# Altium project CT8042.PrjPcb
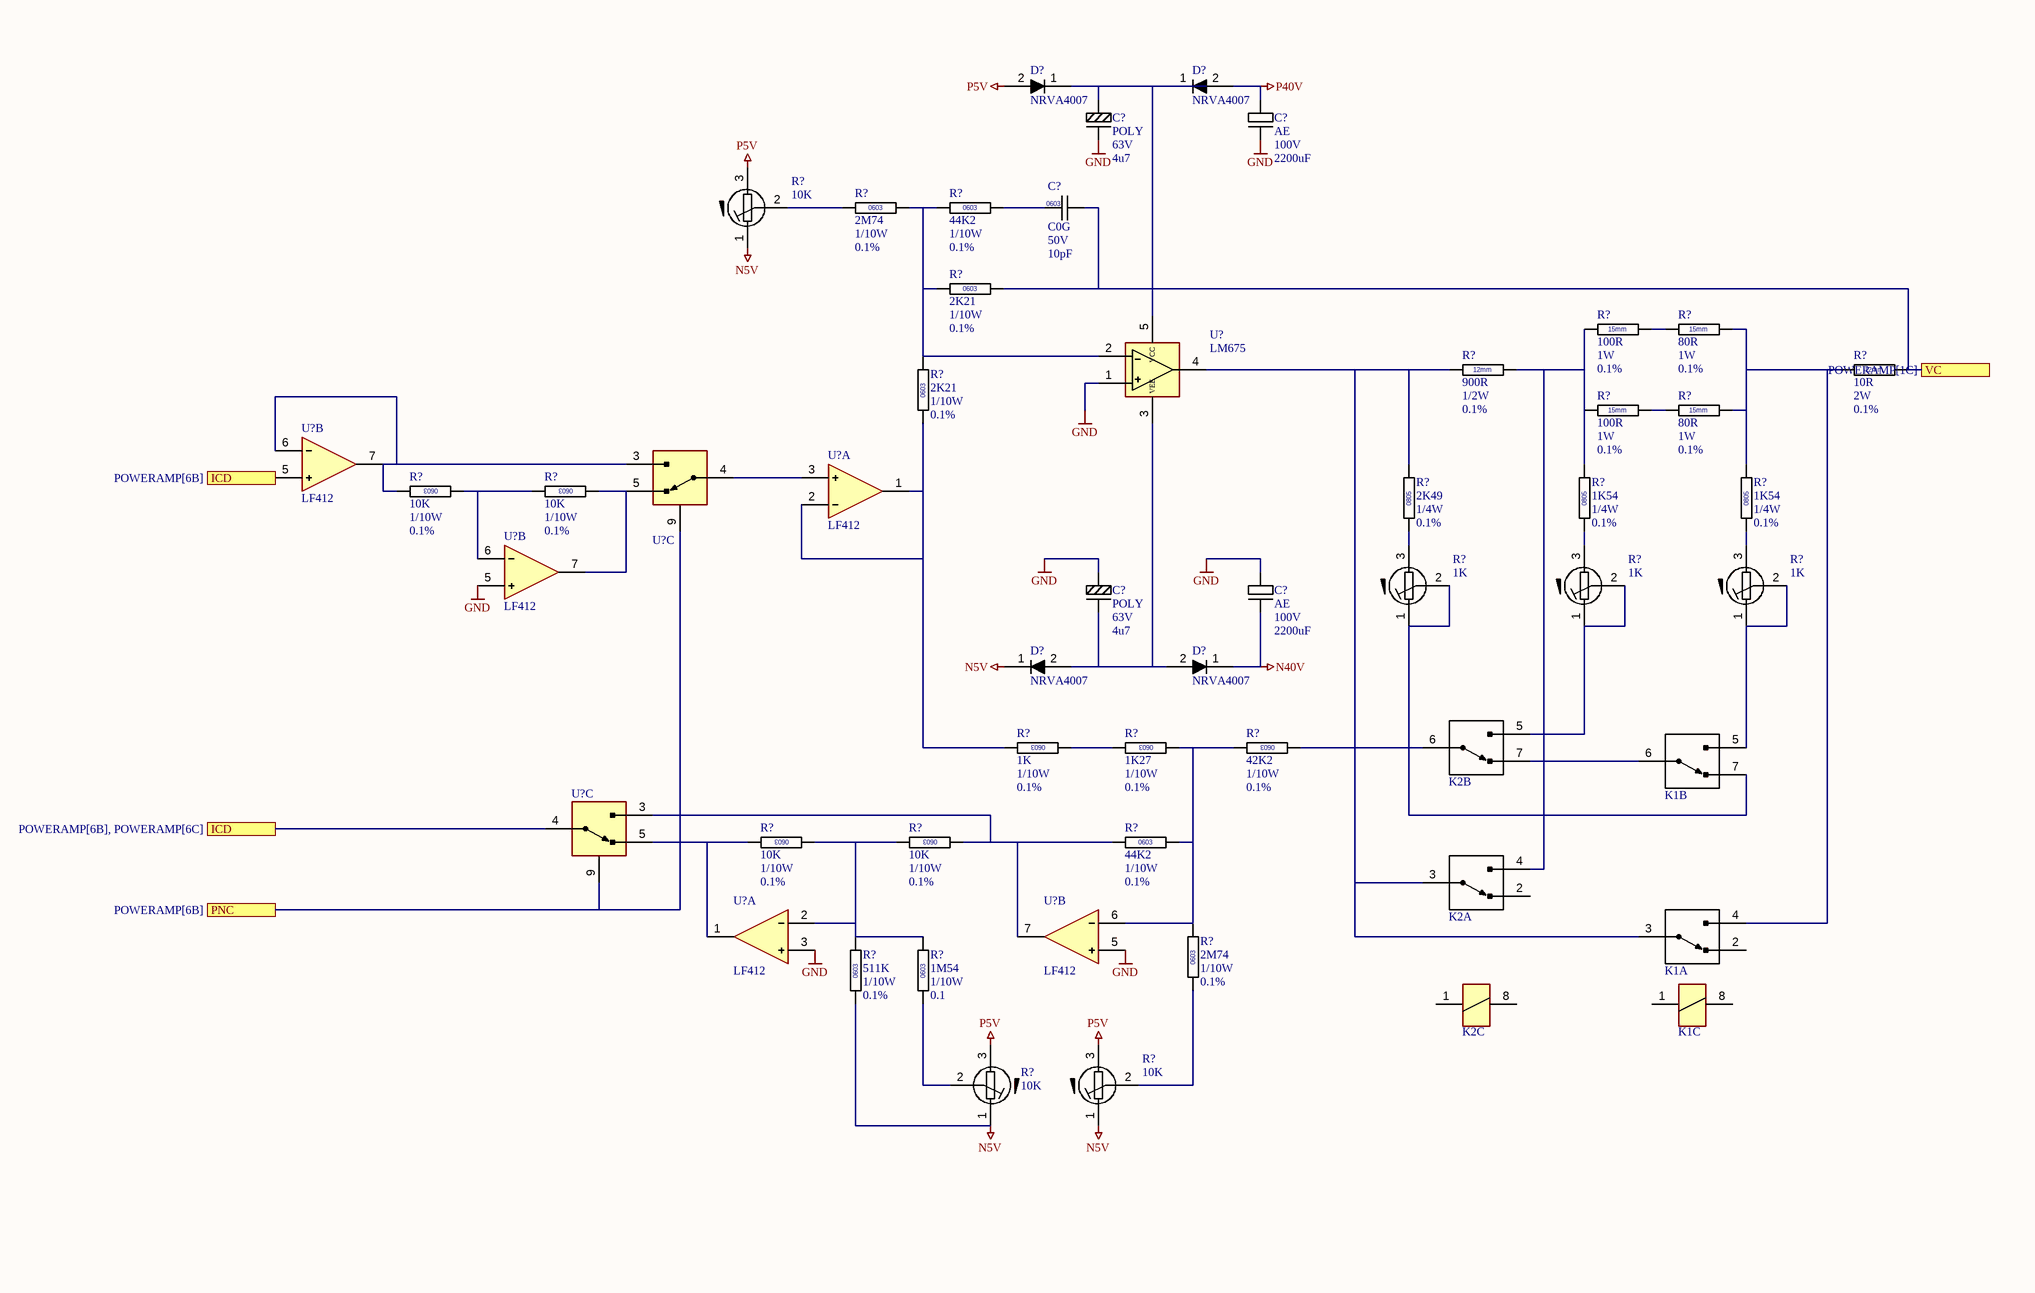
[diagram p0: POWERAMP.SchDoc]
1 sheet, 49 parts. Net scope: flat (ports and power ports of the same name join across sheets).

## Sheet POWERAMP.SchDoc
size B

### Parts
(Parts that share a designator on the sheet are numbered #1, #2 ... from top to bottom, then left to right.)
C?#1  Dielectric: POLY  Voltage: 63V  Capacitance: 4u7  [CAPC0603]  (hidden comment: CAPP)
C?#2  Dielectric: AE  Voltage: 100V  Capacitance: 2200uF  [CAPC0603]  (hidden comment: CAP0603)
C?#3  Dielectric: C0G  Voltage: 50V  Capacitance: 10pF  [CAPC0603]  (hidden comment: CAP0603)
C?#4  Dielectric: POLY  Voltage: 63V  Capacitance: 4u7  [CAPC0603]  (hidden comment: CAPP)
C?#5  Dielectric: AE  Voltage: 100V  Capacitance: 2200uF  [CAPC0603]  (hidden comment: CAP0603)
D?#1  NRVA4007
D?#2  NRVA4007
D?#3  NRVA4007
D?#4  NRVA4007
K1  RELA-OMRON-OMRON G6K-2F-Y-TR DC5  (value not drawn)  (parts A,B,C of 3)
K2  RELA-OMRON-OMRON G6K-2F-Y-TR DC5  (value not drawn)  (parts A,B,C of 3)
R?#1  value 2M74  Power: 1/10W  Tolerance: 0.1%  [RESC0603]  (hidden comment: RESC0603)
R?#2  value 44K2  Power: 1/10W  Tolerance: 0.1%  [RESC0603]  (hidden comment: RESC0603)
R?#3  value 10K  (hidden comment: TRIMMER-BOURNS-3214X-1-103E)
R?#4  value 2K21  Power: 1/10W  Tolerance: 0.1%  [RESC0603]  (hidden comment: RESC0603)
R?#5  value 100R  Power: 1W  Tolerance: 0.1%  [RESC1206]  (hidden comment: RESC1206)
R?#6  value 80R  Power: 1W  Tolerance: 0.1%  [RESC1206]  (hidden comment: RESC1206)
R?#7  value 900R  Power: 1/2W  Tolerance: 0.1%  [RESC1206]  (hidden comment: RESC1206)
R?#8  value 10R  Power: 2W  Tolerance: 0.1%  [RESC1206]  (hidden comment: RESC1206)
R?#9  value 100R  Power: 1W  Tolerance: 0.1%  [RESC1206]  (hidden comment: RESC1206)
R?#10  value 80R  Power: 1W  Tolerance: 0.1%  [RESC1206]  (hidden comment: RESC1206)
R?#11  value 2K21  Power: 1/10W  Tolerance: 0.1%  [RESC0603]  (hidden comment: RESC0603)
R?#12  value 2K49  Power: 1/4W  Tolerance: 0.1%  [RESC0805]  (hidden comment: RESC0805)
R?#13  value 10K  Power: 1/10W  Tolerance: 0.1%  [RESC0603]  (hidden comment: RESC0603)
R?#14  value 10K  Power: 1/10W  Tolerance: 0.1%  [RESC0603]  (hidden comment: RESC0603)
R?#15  value 1K54  Power: 1/4W  Tolerance: 0.1%  [RESC0805]  (hidden comment: RESC0805)
R?#16  value 1K54  Power: 1/4W  Tolerance: 0.1%  [RESC0805]  (hidden comment: RESC0805)
R?#17  value 1K  (hidden comment: TRIMMER-BOURNS-3214X-1-102E)
R?#18  value 1K  (hidden comment: TRIMMER-BOURNS-3214X-1-102E)
R?#19  value 1K  (hidden comment: TRIMMER-BOURNS-3214X-1-102E)
R?#20  value 1K  Power: 1/10W  Tolerance: 0.1%  [RESC0603]  (hidden comment: RESC0603)
R?#21  value 1K27  Power: 1/10W  Tolerance: 0.1%  [RESC0603]  (hidden comment: RESC0603)
R?#22  value 42K2  Power: 1/10W  Tolerance: 0.1%  [RESC0603]  (hidden comment: RESC0603)
R?#23  value 10K  Power: 1/10W  Tolerance: 0.1%  [RESC0603]  (hidden comment: RESC0603)
R?#24  value 10K  Power: 1/10W  Tolerance: 0.1%  [RESC0603]  (hidden comment: RESC0603)
R?#25  value 44K2  Power: 1/10W  Tolerance: 0.1%  [RESC0603]  (hidden comment: RESC0603)
R?#26  value 511K  Power: 1/10W  Tolerance: 0.1%  [RESC0603]  (hidden comment: RESC0603)
R?#27  value 1M54  Power: 1/10W  Tolerance: 0.1  [RESC0603]  (hidden comment: RESC0603)
R?#28  value 2M74  Power: 1/10W  Tolerance: 0.1%  [RESC0603]  (hidden comment: RESC0603)
R?#29  value 10K  (hidden comment: TRIMMER-BOURNS-3214X-1-103E)
R?#30  value 10K  (hidden comment: TRIMMER-BOURNS-3214X-1-103E)
U?#1  LM675
U?#2  LF412  (part B of 3)
U?#3  IC-TI-CD4053-SPLIT  (value not drawn)  (part C of 4)
U?#4  LF412  (part A of 3)
U?#5  LF412  (part B of 3)
U?#6  IC-TI-CD4053-SPLIT  (value not drawn)  (part C of 4)
U?#7  LF412  (part A of 3)
U?#8  LF412  (part B of 3)

### Ports
ICD (see POWERAMP[6B]), ICD (see POWERAMP[6B], POWERAMP[6C]), PNC (see POWERAMP[6B]), VC (see POWERAMP[1C])

### Nets
GND: C?#1.2 C?#2.2 C?#4.1 C?#5.1 U?#1.1(+) U?#5.5(+) U?#7.3(+) U?#8.5(+)
N5V: D?#3.1(K) R?#3.1 R?#26.2 R?#29.1 R?#30.1
N40V: C?#5.2 D?#4.1(K)
P5V: D?#1.2(A) R?#3.3 R?#29.3 R?#30.3
P40V: C?#2.1 D?#2.2(A)
NetC?#1_1: C?#1.1 D?#1.1(K) D?#2.1(K) U?#1.5(VCC)
NetC?#3_1: C?#3.1 R?#2.2
NetC?#3_2: C?#3.2 R?#4.2 R?#8.1 ; port VC
NetC?#4_2: C?#4.2 D?#3.2(A) D?#4.2(A) U?#1.3(VEE)
NetK1_3: K1.3(COM) K2.3(COM) R?#7.2 R?#12.1 U?#1.4(OUT)
NetK1_4: K1.4(NO) R?#6.1 R?#8.2 R?#10.1 R?#16.2
NetK1_5: K1.5(NO) R?#19.1 R?#19.2
NetK1_6: K1.6(COM) K2.7(NC)
NetK1_7: K1.7(NC) R?#17.1 R?#17.2
NetK2_4: K2.4(NO) R?#5.2 R?#7.1 R?#9.2 R?#15.2
NetK2_5: K2.5(NO) R?#18.1 R?#18.2
NetK2_6: K2.6(COM) R?#22.2
NetR?#1_1: R?#1.1 R?#3.2
NetR?#1_2: R?#1.2 R?#2.1 R?#4.1 R?#11.2 U?#1.2(-)
NetR?#5_1: R?#5.1 R?#6.2
NetR?#9_1: R?#9.1 R?#10.2
NetR?#11_1: R?#11.1 R?#20.1 U?#4.1(O) U?#4.2(-)
NetR?#12_2: R?#12.2 R?#17.3
NetR?#13_1: R?#13.1 U?#2.6(-) U?#2.7(O) U?#3.3(Y)
NetR?#13_2: R?#13.2 R?#14.1 U?#5.6(-)
NetR?#14_2: R?#14.2 U?#3.5(Y1) U?#5.7(O)
NetR?#15_1: R?#15.1 R?#18.3
NetR?#16_1: R?#16.1 R?#19.3
NetR?#20_2: R?#20.2 R?#21.1
NetR?#21_2: R?#21.2 R?#22.1 R?#25.2 R?#28.2 U?#8.6(-)
NetR?#23_1: R?#23.1 U?#6.5(Y1) U?#7.1(O)
NetR?#23_2: R?#23.2 R?#24.1 R?#26.1 R?#27.1 U?#7.2(-)
NetR?#24_2: R?#24.2 R?#25.1 U?#6.3(Y) U?#8.7(O)
NetR?#27_2: R?#27.2 R?#29.2
NetR?#28_1: R?#28.1 R?#30.2
NetU?#2_5: U?#2.5(+) U?#6.4(Y3) ; port ICD
NetU?#3_4: U?#3.4(Y3) U?#4.3(+)
NetU?#3_9: U?#3.9(B) U?#6.9(B) ; port PNC

Not connected (* = marked no-connect by the designer): K1 1 2(NC) 8; K2 1 2(NC) 8

### Notes on the sheet
- DWG. NO.
- REV.
- SHT.
- THIS DOCUMENT AND THE DATA DISCLOSED HEREIN OR HEREWITH IS THE PROPERTY OF ALTIUM LIMITED AND MAY BE FREELY DISTRIBUTED IN WHOLE. NO RIGHTS ARE RESERVED OR EXPRESS OR IMPLIED WARANTEE GIVEN.
- REVISION
- DESCRIPTION
- DATE
- APPROVED
- ENG:
- APPROVALS
- PROJECT
- DSN:
- CHK:
- REFERENCE DOCUMENTS
- PROJECT REVISION:
- TITLE
- DOCUMENT REVISION:
- DESIGN ITEM:
- BOM:
- FAB DWG:
- PCB DWG:
- ASSY DWG:
- SCALE:
- SIZE
- B
- CAGE CODE
- FILE NAME
- DWG NO.
- SHEET
- OF
- REV
- (in symbol RES-12mm-10R-0.1%-2W) 12mm
- (in symbol RES-12mm-900R-0.1%-1/2W) 12mm
- (in symbol RES-15mm-80R-0.1%-1W) 15mm
- (in symbol RES-15mm-100R-0.1%-1W) 15mm
- (in symbol RESC-0603-1K27-0.1%-1/10W) 0603
- (in symbol RESC-0603-1K-0.1%-1/10W) 0603
- (in symbol RESC-0603-1M54-0.1%-1/10W) 0603
- (in symbol RESC-0603-2K21-0.1%-1/10W) 0603
- (in symbol RESC-0603-2M74-0.1%-1/10W) 0603
- (in symbol RESC-0603-10K-0.1%-1/10W) 0603
- (in symbol RESC-0603-42K2-0.1%-1/10W) 0603
- (in symbol RESC-0603-44K2-0.1%-1/10W) 0603
- (in symbol RESC-0603-511K-0.1%-1/10W) 0603
- (in symbol RESC-0805-1K54-0.1%-1/4W) 0805
- (in symbol RESC-0805-2K49-0.1%-1/4W) 0805

### Library data of the parts
C?#1 C?#4 = CAPP-0603-4u7-63V-POLY: CAPACITOR,POLYMER,4u7,63V; Manufacturer 1: PANASONIC; Manufacturer Part Number 1: EEHZC1H101P; Package / Case: CAPP100D102H; Location: *; LCSC: C161937
C?#2 C?#5 = CAPP-AE-2200uF-100V: CAPACITOR,ALU,2200uF,100V; Location: *
C?#3 = CAPC-0603-10PF-50V-C0G: CAPACITOR,CERAMIC,10pF,50V,C0G,0603; Manufacturer 1: KYOCERA; Manufacturer Part Number 1: C0603C100J5GAC; Package / Case: 0603; Location: *; MOUSER: 80-C0603C100J5GAC
D?#1-D?#4 = DIODE-ONSEMI-NRVA4007T3G: DIODE,RECTIFIER,1000V,1A,ONSEMI,NRVA4007,SMA; DIGIKEY: NRVA4007T3GOSCT-ND; Manufacturer 1: ONSEMI; Manufacturer Part Number 1: NRVA4007T3G
R?#1 R?#28 = RESC-0603-2M74-0.1%-1/10W: RESISTOR,2M74,0.1%,100mW,0603 (1608); Location: *
R?#2 R?#25 = RESC-0603-44K2-0.1%-1/10W: RESISTOR,44K2,0.1%,100mW,0603 (1608); Location: *
R?#3 R?#29 R?#30 = TRIMMER-BOURNS-3214X-1-103E: RESISTOR,MULTITURN,VERTICAL,5T,10K; Manufacturer 1: BOURNS; Manufacturer Part Number 1: 3214X-1-102E
R?#4 R?#11 = RESC-0603-2K21-0.1%-1/10W: RESISTOR,2K21,0.1%,100mW,0603 (1608); Location: *
R?#5 R?#9 = RES-15mm-100R-0.1%-1W: RESISTOR,100R,TH15mm,0.1%,1W,CMF60; Manufacturer 1: VISHAY; Manufacturer Part Number 1: CMF60100R00BHEB; Location: *; Parameter 4: *
R?#6 R?#10 = RES-15mm-80R-0.1%-1W: RESISTOR,80R,TH15mm,0.1%,1W,CMF60; Manufacturer 1: VISHAY; Manufacturer Part Number 1: CMF6080R000BHEB; Location: *; Parameter 4: *
R?#7 = RES-12mm-900R-0.1%-1/2W: RESISTOR,900R,TH12mm,0.1%,1/2W,0805; Manufacturer 1: VISHAY; Manufacturer Part Number 1: CMF55900R00BHEB; Location: *; Parameter 4: *
R?#8 = RES-12mm-10R-0.1%-2W: RESISTOR,10R,TH12mm,0.1%,2W,0805; Location: *; Parameter 4: *
R?#12 = RESC-0805-2K49-0.1%-1/4W: RESISTOR,2K49,0.1%,250mW,0805; Manufacturer 1: TE; Manufacturer Part Number 1: RP73PF2A2K49BTDF; Location: *; Parameter 4: *
R?#13 R?#14 R?#23 R?#24 = RESC-0603-10K-0.1%-1/10W: RESISTOR,10K,0.1%,100mW,0603 (1608); Location: *
R?#15 R?#16 = RESC-0805-1K54-0.1%-1/4W: RESISTOR,1K54,0.1%,250mW,0805; Manufacturer 1: TE; Manufacturer Part Number 1: RP73PF2A1K54BTDF; Location: *; Parameter 4: *
R?#17-R?#19 = TRIMMER-BOURNS-3214X-1-102E: RESISTOR,MULTITURN,VERTICAL,5T,1K; Manufacturer 1: BOURNS; Manufacturer Part Number 1: 3214X-1-102E
R?#20 = RESC-0603-1K-0.1%-1/10W: RESISTOR,1K,0.1%,100mW,0603 (1608); Location: *
R?#21 = RESC-0603-1K27-0.1%-1/10W: RESISTOR,1K27,0.1%,100mW,0603 (1608); Location: *
R?#22 = RESC-0603-42K2-0.1%-1/10W: RESISTOR,42K2,0.1%,100mW,0603 (1608); Location: *
R?#26 = RESC-0603-511K-0.1%-1/10W: RESISTOR,511K,0.1%,100mW,0603 (1608); Location: *
R?#27 = RESC-0603-1M54-0.1%-1/10W: RESISTOR,1M54,0.1%,100mW,0603 (1608); Location: *
U?#1 = IC-TI-LM675-TO220-5: IC,OPAMP,SINGLE,POWER,LM675,TO220-5
U?#2 U?#4 U?#5 U?#7 U?#8 = IC-TI-LF412-DIL8: IC,OPAMP JFET,DUAL,LF412,DIL8
U?#3 U?#6 = IC-TI-CD4053-SPLIT: IC,MUX,TRIPLE 2:1 MUX,SPLIT BLOCKS